# EAGLE design wchasp_v3 (EAGLE 7.7.0)
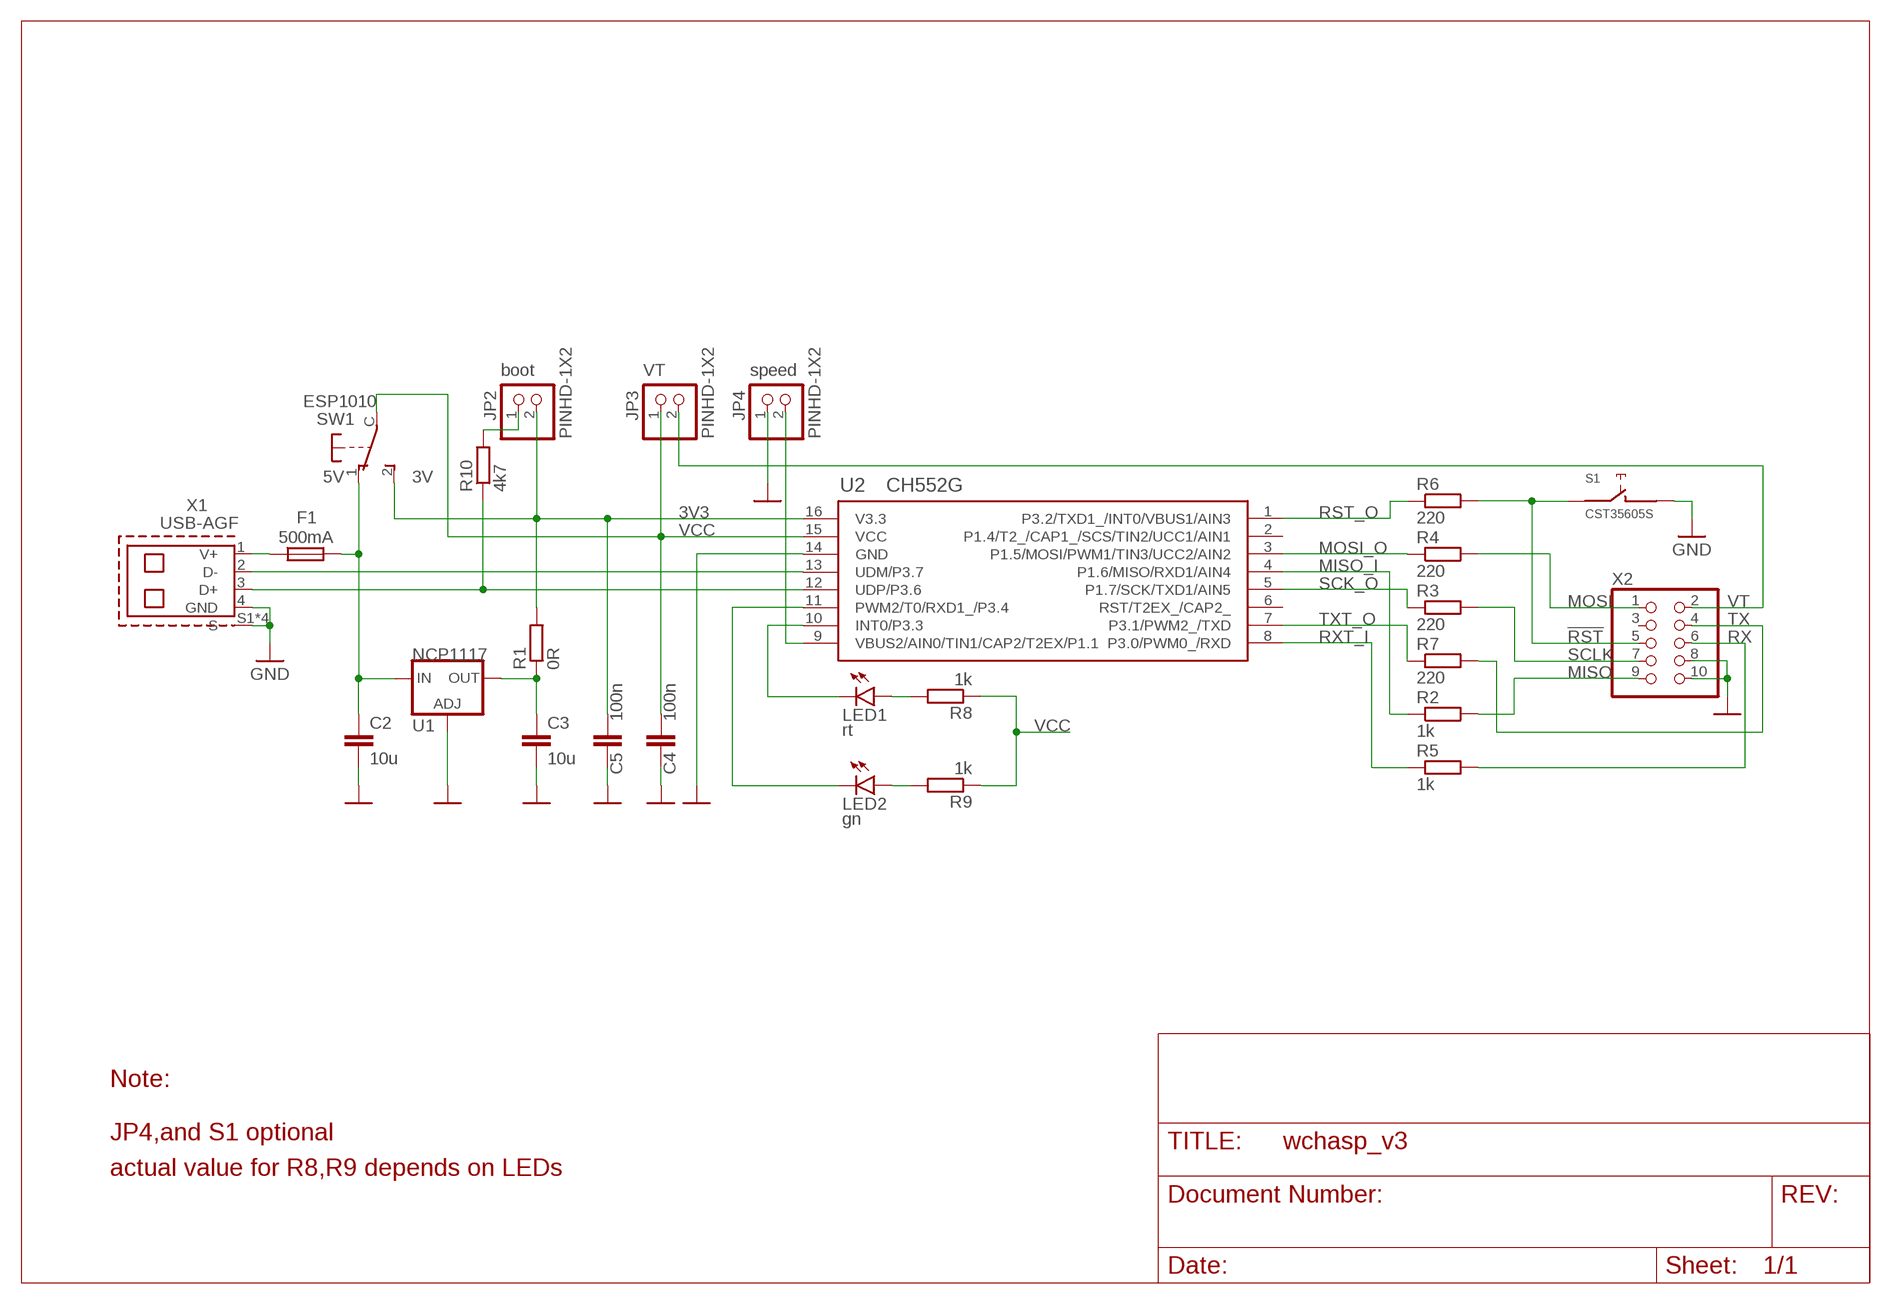
[diagram p0: schematic, sheet 1]

## Parts
C2  10u  C-EUC0805K  [C0805K]
C3  10u  C-EUC0805K  [C0805K]
C4  100n  C-EUC0603  [C0603]
C5  100n  C-EUC0603  [C0603]
F1  500mA  R-EU_R0805W  [R0805W]
JP2  PINHD-1X2  [1X2]
JP3  PINHD-1X2  [1X2]
JP4  PINHD-1X2  [1X2]
LED1  rt  LED_0603  [D0603]
LED2  gn  LED_0603  [D0603]
R1  0R  R-EU_R0603  [R0603]
R2  1k  R-EU_R0603  [R0603]
R3  220  R-EU_R0603  [R0603]
R4  220  R-EU_R0603  [R0603]
R5  1k  R-EU_R0603  [R0603]
R6  220  R-EU_R0603  [R0603]
R7  220  R-EU_R0603  [R0603]
R8  1k  R-EU_R0603  [R0603]
R9  1k  R-EU_R0603  [R0603]
R10  4k7  R-EU_R0603  [R0603]
S1  CST35605S  [CST35605S]
SW1  ESP1010  [ESP1010]
U1  NCP1117  [SOT223]
U2  CH552G  [SO16]
X1  USB-AGF  [USB-AGF]
X2  PINHD-2X5/90  [2X05/90]

## Nets
3V3: C5.1 JP2.2 R1.2 SW1.2(S) U2.16(V3.3)
!RST: R6.2 S1.1 X2.5
GND: C2.2 C3.2 C4.2 C5.2 JP4.1 S1.2 U1.1(ADJ) U2.14(GND) X1.4(GND) X1.S1(S) X1.S2(S) X1.S3(S) X1.S4(S) X2.8 X2.10
MISO: R2.2 X2.9
MISO_I: R2.1 U2.4(P1.6/MISO/RXD1/AIN4)
MOSI: R4.2 X2.1
MOSI_O: R4.1 U2.3(P1.5/MOSI/PWM1/TIN3/UCC2/AIN2)
N$1: JP2.1 R10.2
N$2: U2.13(UDM/P3.7) X1.2(D-)
N$3: R10.1 U2.12(UDP/P3.6) X1.3(D+)
N$4: LED1.A R8.2
N$5: C2.1 F1.2 SW1.1(O) U1.3(IN)
N$7: C3.1 R1.1 U1.2(OUT) U1.4(OUT)
N$8: LED2.A R9.2
N$9: LED2.K(C) U2.11(PWM2/T0/RXD1_/P3.4)
N$10: LED1.K(C) U2.10(INT0/P3.3)
N$14: F1.1 X1.1(V+)
RST_O: R6.1 U2.1(P3.2/TXD1_/INT0/VBUS1/AIN3)
RX: R5.2 X2.6
RXT_I: R5.1 U2.8(P3.0/PWM0_/RXD)
SCK_O: R3.1 U2.5(P1.7/SCK/TXD1/AIN5)
SCLK: R3.2 X2.7
SLOW: JP4.2 U2.9(VBUS2/AIN0/TIN1/CAP2/T2EX/P1.1)
TX: R7.2 X2.4
TXT_O: R7.1 U2.7(P3.1/PWM2_/TXD)
VCC: C4.1 JP3.1 R8.1 R9.1 SW1.C U2.15(VCC)
VT: JP3.2 X2.2
Unconnected: U2.2(P1.4/T2_/CAP1_/SCS/TIN2/UCC1/AIN1) U2.6(RST/T2EX_/CAP2_) X2.3

## Notes on the sheet
- boot | VT | speed
- 5V | 3V
- Note:
- JP4,and S1 optional
- actual value for R8,R9 depends on LEDs

## Library data of the parts
C2-C5 = rcl:C-EU: CAPACITOR, European symbol; SPICEPREFIX: C
F1 R1-R10 = rcl:R-EU_: RESISTOR, European symbol; SPICEPREFIX: R
JP2-JP4 = tzlib:PINHD-1X2
LED1 LED2 = tzlib:LED_0603
S1 = tzlib:CST35605S
SW1 = tzlib:ESP1010
U1 = tzlib:NCP1117
U2 = tzlib:CH552G
X1 = tzlib:USB-AGF: Connector; USB; Typ Ar; SMD;Devceside;ultra flat Manufacturer Assmann Ditri Reichelt
X2 = tzlib:PINHD-2X5: PIN HEADER

## Board
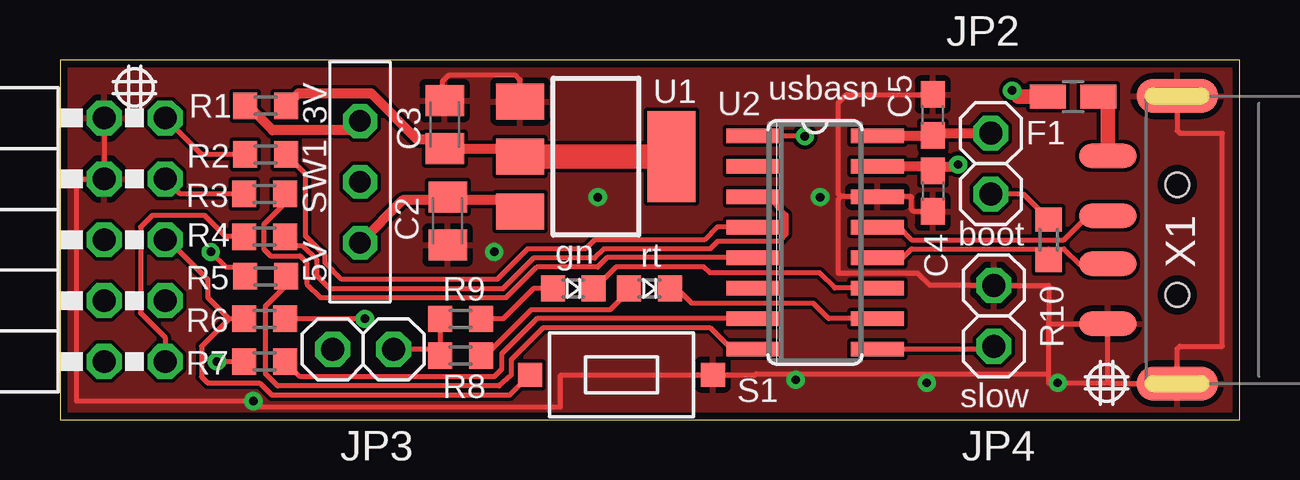
[diagram p1: board, top side]
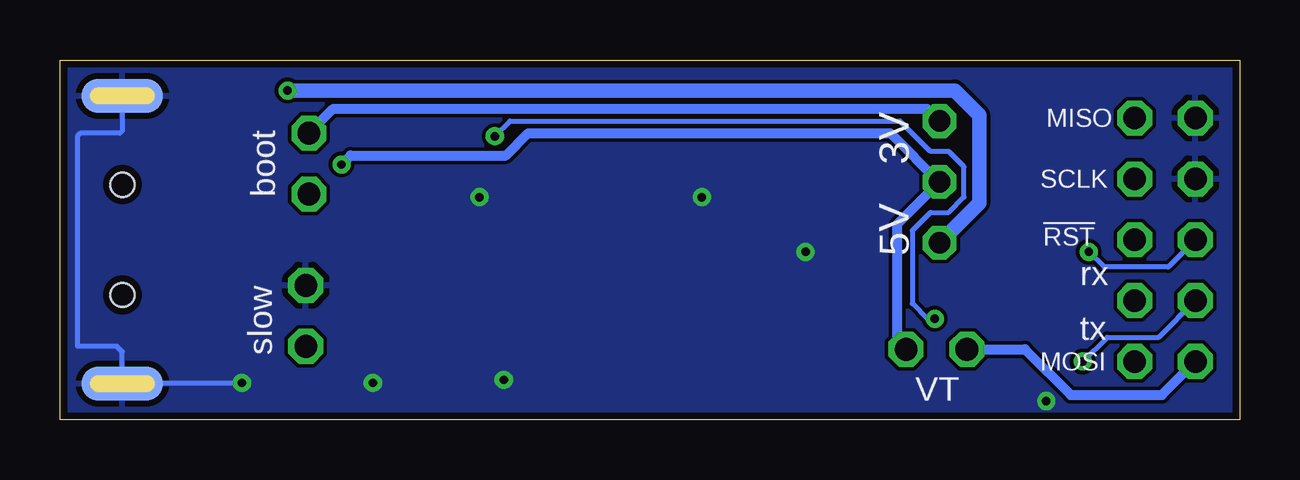
[diagram p2: board, bottom side, seen from below]

Size 49.17 x 15 mm. Coordinates in mm from the lower left corner, seen from the top.
Outline: 0,0 49.17,0 49.17,15 0,15 0,0
Copper layers (1*16): Top 0.035mm / dielectric 1.5mm / Bottom 0.035mm
Design rules "default *": minimum track width 8mil, minimum drill 0.35mm, track to track 6mil, track to pad 6mil, pad to pad 6mil, via to via 6mil, smd to smd 6mil, copper to edge 12mil, drill to drill 6mil, minimum pad ring 10mil, minimum via ring 8mil, stop-mask expansion 4mil, vias tented up to drill 0.36mm, thermal gap 10mil

### Footprints (pad centres in the part's own frame; a part is rotated, then mirrored left to right if it is on the bottom)
C0805K = smd 1.3 x 1.6: 1 -1,0; 2 1,0
C0603 = smd 1.1 x 1: 1 -0.85,0; 2 0.85,0
R0805W = smd 1.5 x 1: 1 -1.052,0; 2 1.052,0
1X2 = drill 0.95 pad 1.4 octagon: 1 -1.27,0; 2 1.27,0
D0603 = smd 1 x 1.1: A -0.85,0; K 0.85,0
R0603 = smd 1 x 1.1: 1 -0.85,0; 2 0.85,0
CST35605S = smd 1 x 1: 1 -3.81,0; 2 3.81,0
ESP1010 = drill 0.9 pad 1.4 octagon: 1 -2.54,0; 2 2.54,0; C 0,0
SOT223 = smd 1.5 x 2: 1 -2.3,-3.15; 2 0,-3.15; 3 2.3,-3.15 | smd 3.8 x 2: 4 0,3.15
SO16 = smd 0.6 x 2.2: 1 -3.175,-2.6; 2 -1.905,-2.6; 3 -0.635,-2.6; 4 0.635,-2.6; 5 1.905,-2.6; 6 3.175,-2.6; 7 4.445,-2.6; 8 5.715,-2.6; 9 5.715,2.6; 10 4.445,2.6; 11 3.175,2.6; 12 1.905,2.6; 13 0.635,2.6; 14 -0.635,2.6; 15 -1.905,2.6; 16 -3.175,2.6
USB-AGF = smd 2.4 x 1: 1 4.5,-3.5; 2 4.5,-1; 3 4.5,1; 4 4.5,3.5 | smd 3.4 x 1.4: S1 1.6,6; S2 1.6,-6 | smd 3.4 x 1.4 bottom: S3 1.6,6; S4 1.6,-6 | hole 1: 1.6,2.3; 1.6,-2.3
2X05/90 = drill 0.95 pad 1.4 octagon: 1 -5.08,-6.35; 2 -5.08,-3.81; 3 -2.54,-6.35; 4 -2.54,-3.81; 5 0,-6.35; 6 0,-3.81; 7 2.54,-6.35; 8 2.54,-3.81; 9 5.08,-6.35; 10 5.08,-3.81

### Placement (x,y rotation side)
C2  16.16,8.29 270 top
C3  16.04,12.3 90 top
C4  36.38,9.53 270 top
C5  36.38,12.71 90 top
F1  42.23,13.47 180 top
JP2  38.8,10.68 90 top
JP3  12.64,2.93 180 top
JP4  38.92,4.33 270 top
LED1  24.57,5.47 0 top
LED2  21.4,5.47 0 top
R1  8.57,13.09 180 top
R2  8.57,11.06 180 top
R3  8.53,9.41 180 top
R4  8.53,7.63 180 top
R5  8.57,5.98 180 top
R6  8.53,4.2 180 top
R7  8.53,2.42 180 top
R8  16.7,2.67 0 top
R9  16.7,4.2 0 top
R10  41.21,7.5 90 top
S1  23.41,1.87 0 top
SW1  12.51,9.91 90 top
U1  22.34,10.97 270 top
U2  31.47,8.66 270 top
U$1  [CENTER]  3.11,13.85 0 top
U$2  [CENTER]  43.62,1.53 0 top
X1  48.17,7.5 180 top
X2  -1.97,7.5 90 top

### Tracks (layer width: path | path; a pad name or v marks a point on that pad's centre or on a via)
3V3
  Top 0.406: U2.16 36.36,11.83 C5.1 36.47,11.95 JP2.2 | R1.2 7.85,13.09 8.86,12.07 12.13,12.07 SW1.2
  Bottom 0.406: JP2.2 37.78,12.96 13.02,12.96 SW1.2
!RST
  Top 0.203: R6.2 7.05,4.2 | 7.05,4.2 5.9,3.06 5.9,1.79 6.03,1.66 6.16,1.53 8.32,1.53 8.82,1.02 18.75,1.02 S1.1 | X2.5 4.51,7.5 6.16,5.85 6.16,5.09 7.04,4.2 7.05,4.2
GND  (via drill 0.35)
  Top 0.203: 32.56,9.29 U2.14 35.48,9.29 35.5,9.28 35.5,8.77 35.58,8.68 C4.2 | 32.56,9.29 32.45,9.4 32.45,13.21 32.79,13.56 C5.2 | 41.21,4.07 41.21,5.59 JP4.1 36.26,5.59 35.75,6.1 32.45,6.1 32.45,9.18 32.56,9.29 | 41.21,4.07 41.28,4 X1.4 43.67,1.61 43.69,1.59 | 41.21,1.91 29.02,1.91 28.94,1.83 20.85,1.83 20.85,0.51 8.32,0.51 v8.06,0.77 0.7,0.77 0.7,10.04 X2.8 X2.10 | 41.21,1.91 41.21,1.53 v41.59,1.53 43.62,1.53 43.69,1.59 | 41.21,1.91 41.21,4.07 | U1.1 19.19,14.16 18.98,14.36 16.19,14.36 15.94,14.1 15.94,13.4 C3.2 | 43.69,1.59 43.78,1.5 X1.S1 46.57,2.96 46.67,3.05 48.45,3.05 48.45,11.95 46.67,11.95 46.57,12.04 X1.S2
  Bottom 0.203: X1.S2 46.57,12.04 46.67,11.95 48.32,11.95 48.45,11.82 48.45,3.05 46.8,3.05 46.57,2.83 X1.S1 46.54,1.53 v41.59,1.53
  other vias: 36.13,1.53 30.67,1.66 31.68,9.28 22.41,9.28 18.1,6.99
  pour Bottom: -8.96,16.26 -8.96,-1.26 50.99,-1.26 50.99,16.26
  pour Top: -8.96,16.39 50.99,16.39 50.99,-1.26 -8.96,-1.26
MISO
  Top 0.203: R2.2 5.9,11.06 X2.9
MISO_I
  Top 0.203: U2.4 27.38,8.02 26.86,7.5 22.29,7.5 21.91,7.12 19.49,7.12 18.22,5.85 11.75,5.85 11.05,6.55 11.05,6.85 10.22,7.67 10.22,10.25 R2.1
MOSI
  Top 0.203: R4.2 6.92,7.63 6.03,8.52 3.85,8.52 3.36,8.03 3.36,4.45 4.38,3.44 X2.1
MOSI_O
  Top 0.203: U2.3 29.51,9.29 30.27,8.53 30.27,7.73 29.97,7.43 27.41,7.43 27.1,7.12 22.67,7.12 22.29,6.74 19.75,6.74 18.48,5.47 11.24,5.47 10.69,6.01 10.69,6.7 10.14,7.25 9.51,7.25 9.38,7.38 R4.1
N$1
  Top 0.203: R10.2 40.16,9.4 JP2.1
N$2
  Top 0.203: U2.13 34.97,8.02 35.5,7.5 41.84,7.5 42.84,8.5 X1.2
N$3
  Top 0.203: U2.12 35.13,6.75 35.5,7.12 41.21,7.12 | 41.21,7.12 41.84,7.12 42.48,6.48 43.66,6.48 X1.3 | R10.1 41.21,7.12
N$4
  Top 0.203: R8.2 17.74,2.67 19.64,4.58 22.93,4.58 23.72,5.37 LED1.A
N$5  (via drill 0.35)
  Top 0.406: U1.3 18.7,9.16 16.29,9.16 C2.1 16.03,9.15 14.29,9.15 SW1.1
  Top 0.61: F1.2 39.94,13.47 v39.69,13.72
  Bottom 0.61: SW1.1 10.86,9.02 10.86,12.71 11.87,13.72 v39.69,13.72
N$7
  Top 0.406: R1.1 9.93,13.6 12.98,13.6 14.89,11.68 15.66,11.68 C3.1 18.85,11.3 U1.2
  Top 1.016: U1.2 U1.4
N$8
  Top 0.203: R9.2 18.48,4.2 19.75,5.47 LED2.A
N$9
  Top 0.203: U2.11 32.29,5.48 31.66,6.12 27.09,6.12 26.83,6.37 23.18,6.37 22.66,5.85 22.63,5.85 LED2.K
N$10
  Top 0.203: U2.10 32.04,4.21 31.4,4.85 26.33,4.85 25.72,5.47 LED1.K
N$14
  Top 0.61: X1.1 43.67,13.07 F1.1
RST_O  (via drill 0.35)
  Top 0.203: v12.71,4.2 R6.1 | U2.1 31.03,11.83 v31.05,11.82
  Bottom 0.203: v12.71,4.2 13.01,4.2 13.65,4.84 13.65,7.88 12.89,8.64 12.13,8.64 11.49,9.28 11.49,10.55 12.13,11.18 12.89,11.18 14.16,12.45 30.42,12.45 v31.05,11.82
RX  (via drill 0.35)
  Top 0.203: R5.2 7.34,6.36 6.93,6.36 v6.29,7
  Bottom 0.203: X2.6 2.98,6.36 5.65,6.36 v6.29,7
RXT_I
  Top 0.203: U2.8 27.99,2.94 27.11,3.82 20.13,3.82 18.81,2.5 18.81,1.85 18.31,1.4 9.08,1.4 8.57,1.91 8.57,4.75 9.42,5.59 R5.1
SCK_O
  Top 0.203: U2.5 22.81,6.75 22.41,6.36 19.87,6.36 18.6,5.09 10.86,5.09 10.29,5.66 10.29,6.55 10.01,6.83 8.78,6.83 8.49,7.11 8.49,8.14 9.38,9.03 R3.1
SCLK
  Top 0.203: R3.2 5.01,9.41 X2.7
SLOW
  Top 0.203: U2.9 38.81,2.94 JP4.2
TX  (via drill 0.35)
  Top 0.203: v6.54,2.42 R7.2
  Bottom 0.203: X2.4 3.36,3.44 5.52,3.44 v6.54,2.42
TXT_O
  Top 0.203: U2.7 19.89,4.21 18.42,2.74 18.42,2.1 18.1,1.79 13.65,1.79 10.02,1.79 R7.1
VCC  (via drill 0.35)
  Top 0.203: R8.1 R9.1 15.85,2.93 JP3.1
  Top 0.406: U2.15 36.2,10.56 C4.1 36.55,10.55 37.4,10.55 37.44,10.59 v37.44,10.64
  Bottom 0.406: v37.44,10.64 37.06,11.02 30.58,11.02 29.65,11.95 14.56,11.95 12.53,9.91 SW1.C 14.29,8.13 14.29,3.31 JP3.1
VT
  Bottom 0.406: JP3.2 8.95,2.93 7.05,1.02 3.24,1.02 X2.2

### Text on the board
tPlace: usbasp | 3V | boot | gn | rt | 5V | slow
bPlace: MISO | 3V | boot | SCLK | 5V | !RST | rx | slow | tx | MOSI | VT